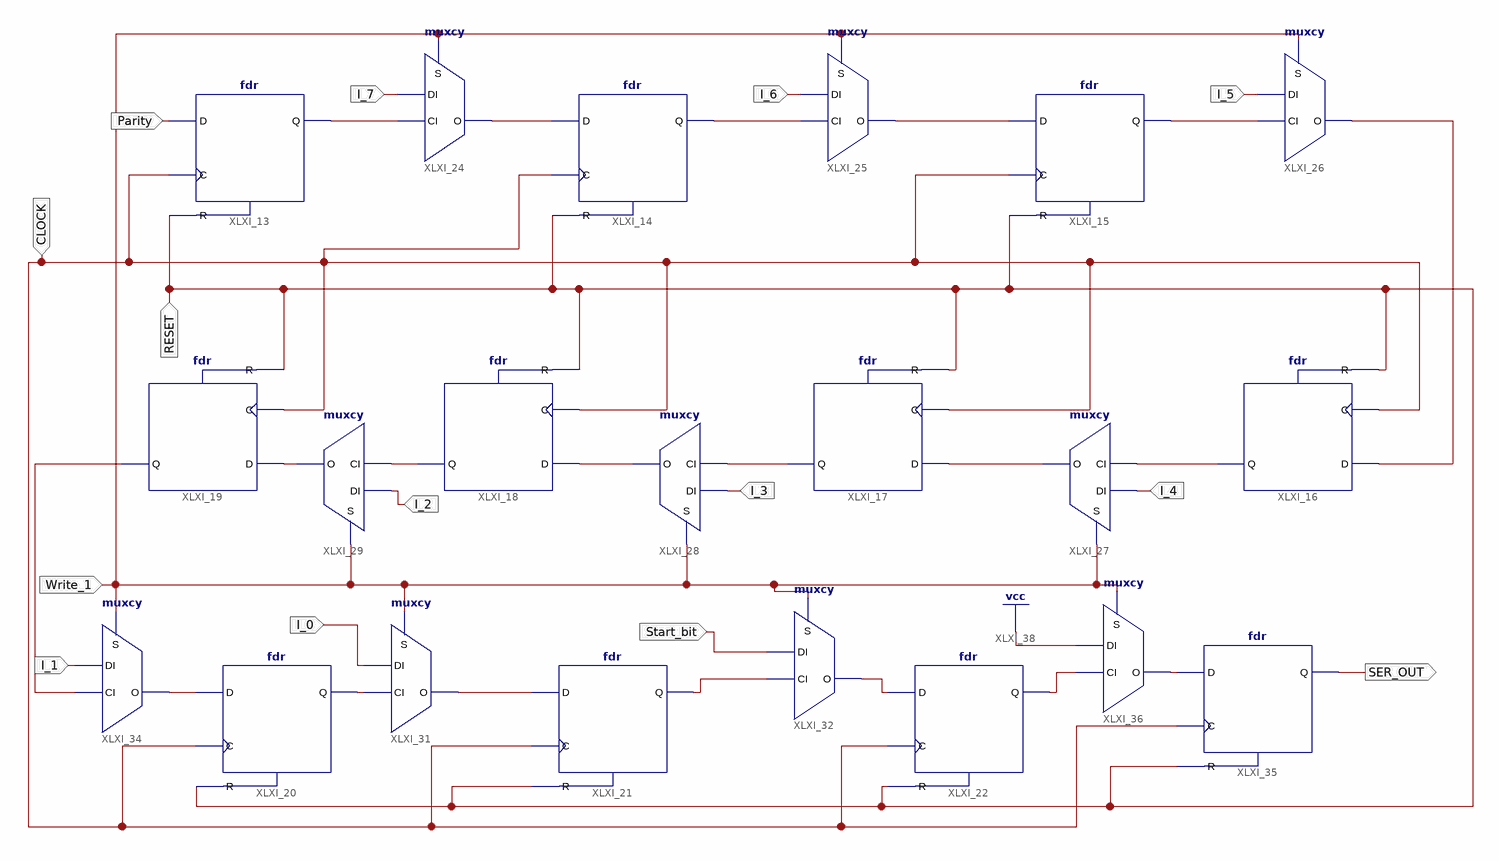
[diagram p0: schematic sheet 1]
// Xilinx ISE schematic shift_reg_8bit.sch (spartan3e) as structural Verilog: 21 symbols, 14 ports
module shift_reg_8bit (
  input  RESET,
  input  Parity,
  input  I_7,
  input  I_6,
  input  I_5,
  input  I_4,
  input  I_3,
  input  I_2,
  input  I_1,
  input  I_0,
  input  Start_bit,
  input  CLOCK,
  input  Write_1,
  output SER_OUT
);

  wire XLXN_49, XLXN_50, XLXN_52, XLXN_53, XLXN_54, XLXN_55, XLXN_56, XLXN_57, XLXN_58, XLXN_60, XLXN_61,
       XLXN_62, XLXN_63, XLXN_64, XLXN_65, XLXN_67, XLXN_68, XLXN_98, XLXN_105;

  fdr XLXI_13 (.C(CLOCK), .D(Parity), .R(RESET), .Q(XLXN_62));
  fdr XLXI_14 (.C(CLOCK), .D(XLXN_65), .R(RESET), .Q(XLXN_63));
  fdr XLXI_15 (.C(CLOCK), .D(XLXN_67), .R(RESET), .Q(XLXN_64));
  fdr XLXI_16 (.C(CLOCK), .D(XLXN_68), .R(RESET), .Q(XLXN_58));
  fdr XLXI_17 (.C(CLOCK), .D(XLXN_54), .R(RESET), .Q(XLXN_57));
  fdr XLXI_18 (.C(CLOCK), .D(XLXN_55), .R(RESET), .Q(XLXN_49));
  fdr XLXI_19 (.C(CLOCK), .D(XLXN_56), .R(RESET), .Q(XLXN_98));
  fdr XLXI_20 (.C(CLOCK), .D(XLXN_50), .R(RESET), .Q(XLXN_61));
  fdr XLXI_21 (.C(CLOCK), .D(XLXN_53), .R(RESET), .Q(XLXN_60));
  fdr XLXI_22 (.C(CLOCK), .D(XLXN_52), .R(RESET), .Q(SER_OUT));
  muxcy XLXI_24 (.CI(XLXN_62), .DI(I_7), .S(Write_1), .O(XLXN_65));
  muxcy XLXI_25 (.CI(XLXN_63), .DI(I_6), .S(Write_1), .O(XLXN_67));
  muxcy XLXI_26 (.CI(XLXN_64), .DI(I_5), .S(Write_1), .O(XLXN_68));
  muxcy XLXI_27 (.CI(XLXN_58), .DI(I_4), .S(Write_1), .O(XLXN_54));
  muxcy XLXI_28 (.CI(XLXN_57), .DI(I_3), .S(Write_1), .O(XLXN_55));
  muxcy XLXI_29 (.CI(XLXN_49), .DI(I_2), .S(Write_1), .O(XLXN_56));
  muxcy XLXI_31 (.CI(XLXN_61), .DI(I_0), .S(Write_1), .O(XLXN_53));
  muxcy XLXI_32 (.CI(XLXN_60), .DI(Start_bit), .S(Write_1), .O(XLXN_52));
  muxcy XLXI_34 (.CI(XLXN_98), .DI(I_1), .S(Write_1), .O(XLXN_50));
  muxcy XLXI_36 (.CI(SER_OUT), .DI(1'b1), .S(Write_1), .O(XLXN_105));
  fdr XLXI_35 (.C(CLOCK), .D(XLXN_105), .R(RESET), .Q(SER_OUT));
endmodule
